# EAGLE design serial led controller programmieradapter (EAGLE 6.4)
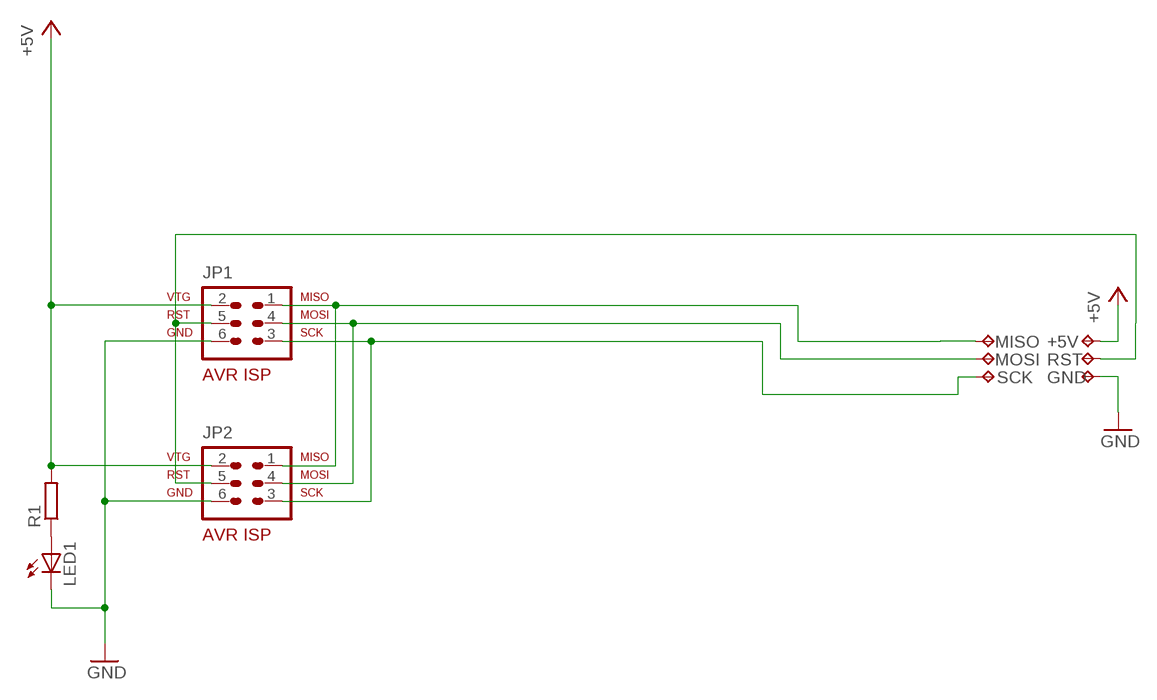
[diagram p0: schematic, sheet 1]

## Parts
+5V  TPTP19R  [TP19R]
GND  TPTP19R  [TP19R]
JP1  AVR-ISP-6  [AVR-ISP-6]
JP2  AVR-ISP-6  [AVR-ISP-6]
LED1  LED3MM  [LED3MM]
MISO  TPTP19R  [TP19R]
MOSI  TPTP19R  [TP19R]
R1  R-EU_0207/10  [0207/10]
RST  TPTP19R  [TP19R]
SCK  TPTP19R  [TP19R]

## Nets
+5V: +5V.TP JP1.2 JP2.2 R1.2
GND: GND.TP JP1.6 JP2.6 LED1.K(C)
MISO: JP1.1 JP2.1 MISO.TP
N$1: LED1.A R1.1
N$2: JP1.4 JP2.4 MOSI.TP
RST: JP1.5 JP2.5 RST.TP
SCK: JP1.3 JP2.3 SCK.TP

## Library data of the parts
+5V GND MISO MOSI RST SCK = testpad:TP: Test pad
JP1 JP2 = 0_avr:AVR-ISP-6: AVR ISP-6 Serial Programming Header
LED1 = 0_Led:LED: LED
R1 = 0_Standard-Parts:R-EU_: RESISTOR, European symbol

## Board
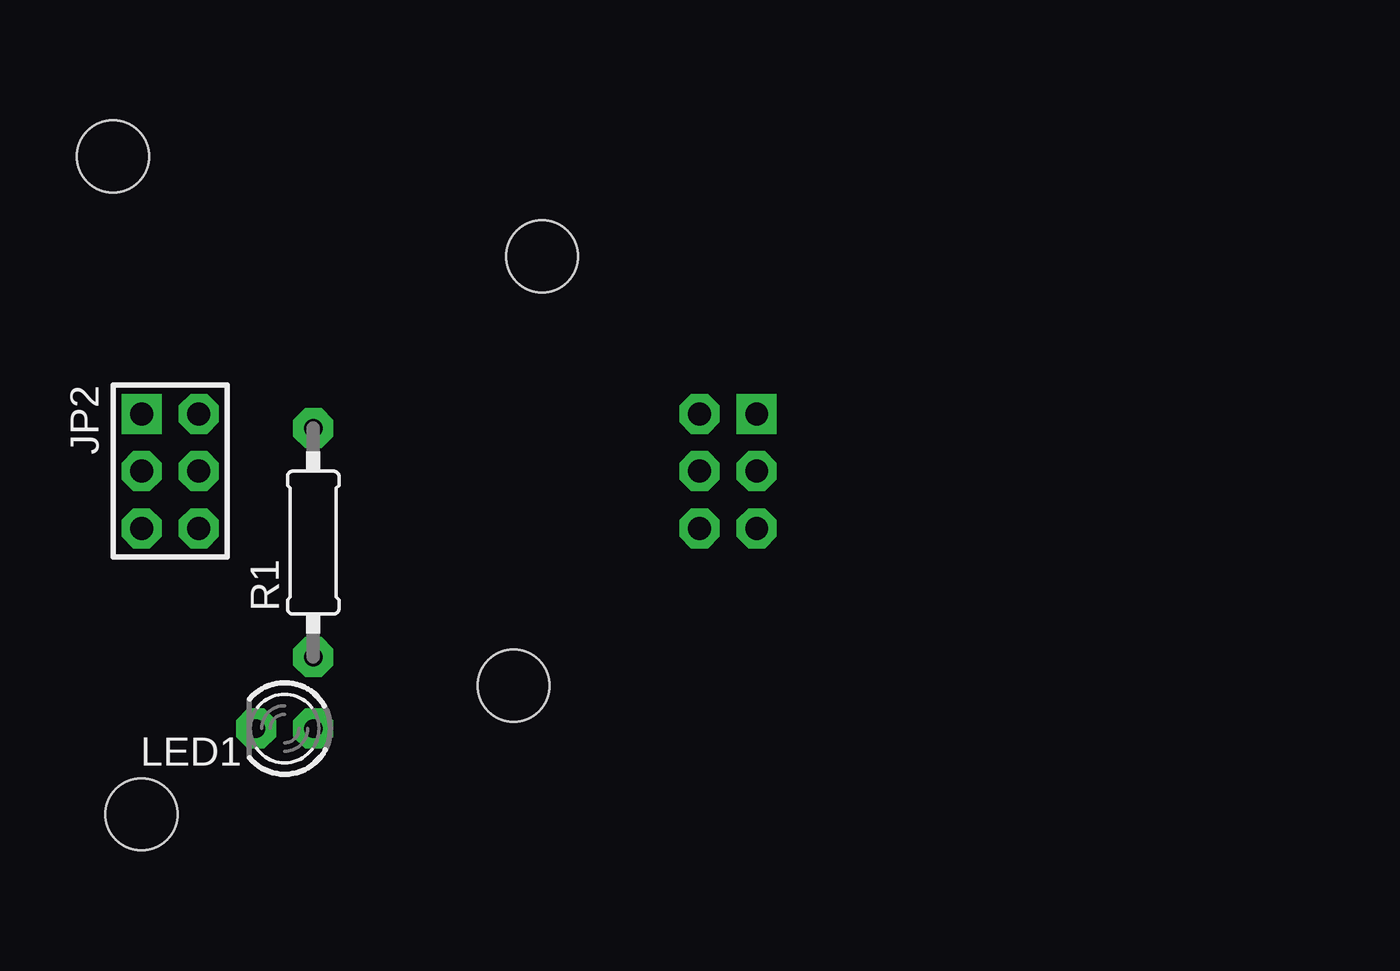
[diagram p1: board, top side]
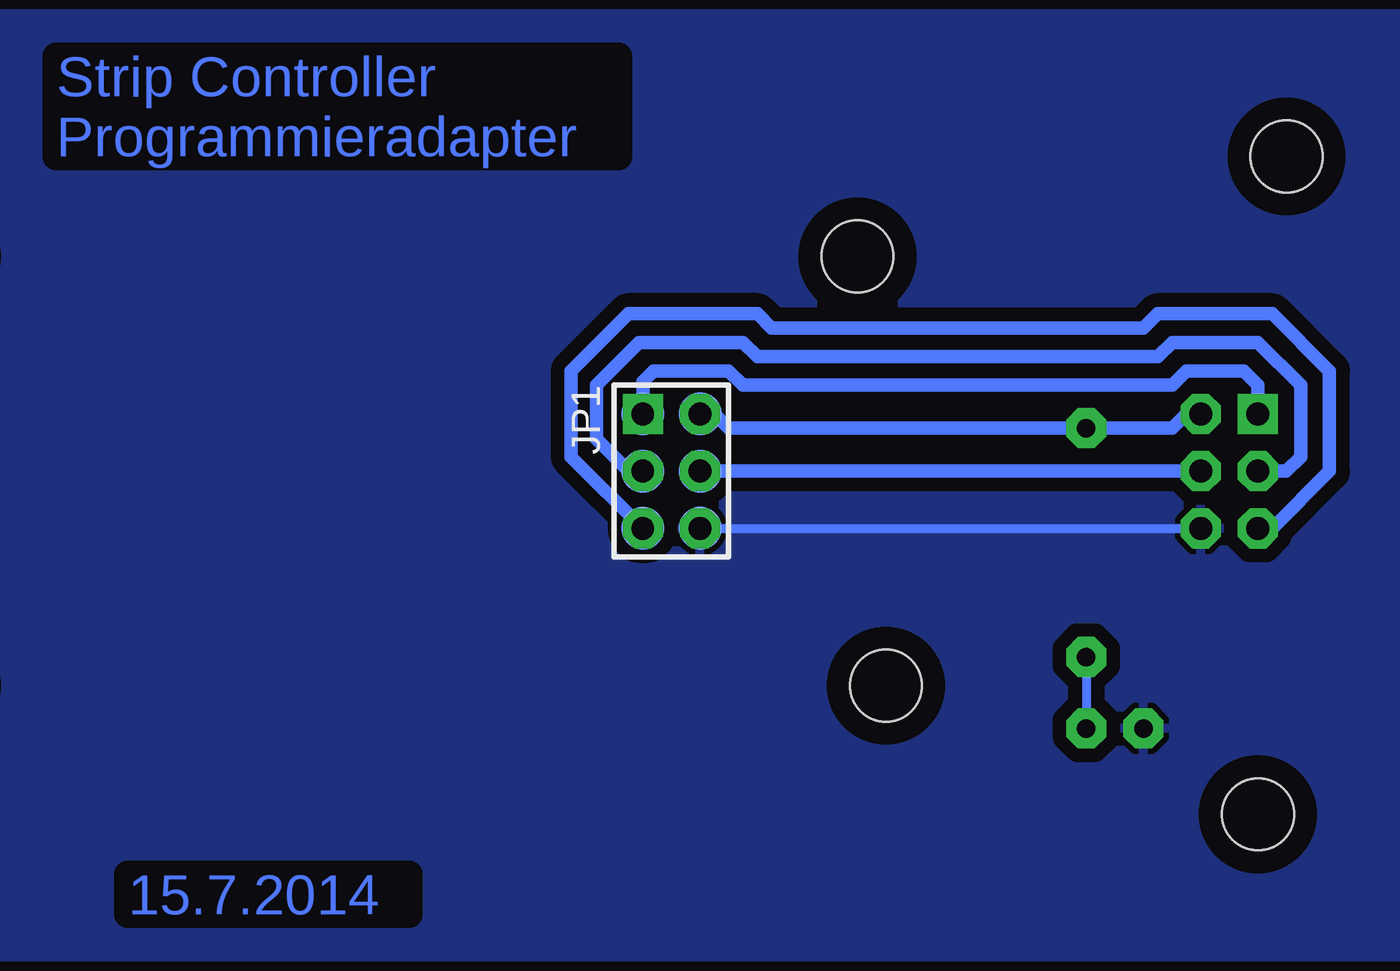
[diagram p2: board, bottom side, seen from below]

No outline drawn. Coordinates in mm, seen from the top.
Copper layers (1*16): Top 0.035mm / dielectric 1.5mm / Bottom 0.035mm
Design rules "Bilex DRU *": minimum track width 10mil, minimum drill 24mil, track to track 10mil, track to pad 10mil, pad to pad 10mil, via to via 10mil, smd to smd 10mil, copper to edge 40mil, drill to drill 8mil, minimum pad ring 10mil, minimum via ring 8mil, stop-mask expansion 4mil, vias tented up to drill 0mil, thermal gap 10mil
Holes 3.2 mm at 66.04,24.77 66.04,5.71 24.13,5.71 25.4,24.77 6.35,29.21 7.62,0 76.2,0 76.2,29.21

### Footprints (pad centres in the part's own frame; a part is rotated, then mirrored left to right if it is on the bottom)
TP19R = smd 1.9 x 1.9: TP 0,0
AVR-ISP-6 = drill 1.016 pad 1.778 square: 1 -2.54,-1.27 | drill 1.016 pad 1.778 octagon: 2 -2.54,1.27; 3 0,-1.27; 4 0,1.27; 5 2.54,-1.27; 6 2.54,1.27
LED3MM = drill 0.813 pad 1.778 octagon: A -1.27,0; K 1.27,0
0207/10 = drill 0.813 pad 1.778 octagon: 1 -5.08,0; 2 5.08,0

### Placement (x,y rotation side)
+5V  32.38,17.78 270 bottom
GND  32.38,12.7 270 bottom
JP1  33.66,15.24 270 bottom
JP2  8.89,15.24 270 top
LED1  13.97,3.81 180 top
MISO  34.92,17.78 270 bottom
MOSI  32.38,15.24 270 bottom
R1  15.24,12.06 90 top
RST  34.92,12.7 270 bottom
SCK  34.92,15.24 270 bottom

### Tracks (layer width: path | path; a pad name or v marks a point on that pad's centre or on a via)
+5V
  Bottom 0.406: 31.75,17.78 JP1.2
  Bottom 0.61: JP2.2 10.79,17.78 11.43,17.14 R1.2 31.11,17.14 31.75,17.78
GND
  Bottom 0.406: JP1.6 JP2.6
  pour Bottom (isolate 0.61): 0,35.56 0,-6.35 82.55,-6.35 82.55,35.56
MISO
  Bottom 0.61: JP2.1 7.62,19.05 8.26,19.68 10.79,19.68 11.43,19.05 30.48,19.05 31.11,19.68 34.45,19.68 34.92,19.21 MISO.TP
N$1
  Bottom 0.406: R1.1 LED1.A
N$2
  Bottom 0.406: MOSI.TP 33.02,15.24 MOSI.TP
  Bottom 0.61: JP2.4 MOSI.TP
RST
  Bottom 0.406: JP2.5 6.99,12.7
  Bottom 0.61: 6.99,12.7 4.45,15.24 4.45,19.68 6.99,22.23 12.06,22.23 12.7,21.59 29.21,21.59 29.84,22.23 35.56,22.23 38.1,19.68 38.1,15.88 RST.TP
SCK
  Bottom 0.61: JP2.3 6.35,15.24 5.71,15.88 5.71,19.05 7.62,20.95 11.43,20.95 12.06,20.32 29.84,20.32 30.48,20.95 35.08,20.95 36.99,19.05 36.99,16.67 35.56,15.24 SCK.TP

### Text on the board
Bottom: Strip Controller / Programmieradapter | 15.7.2014